# Altium project lab3_kulikov_heat_control.PrjPcb
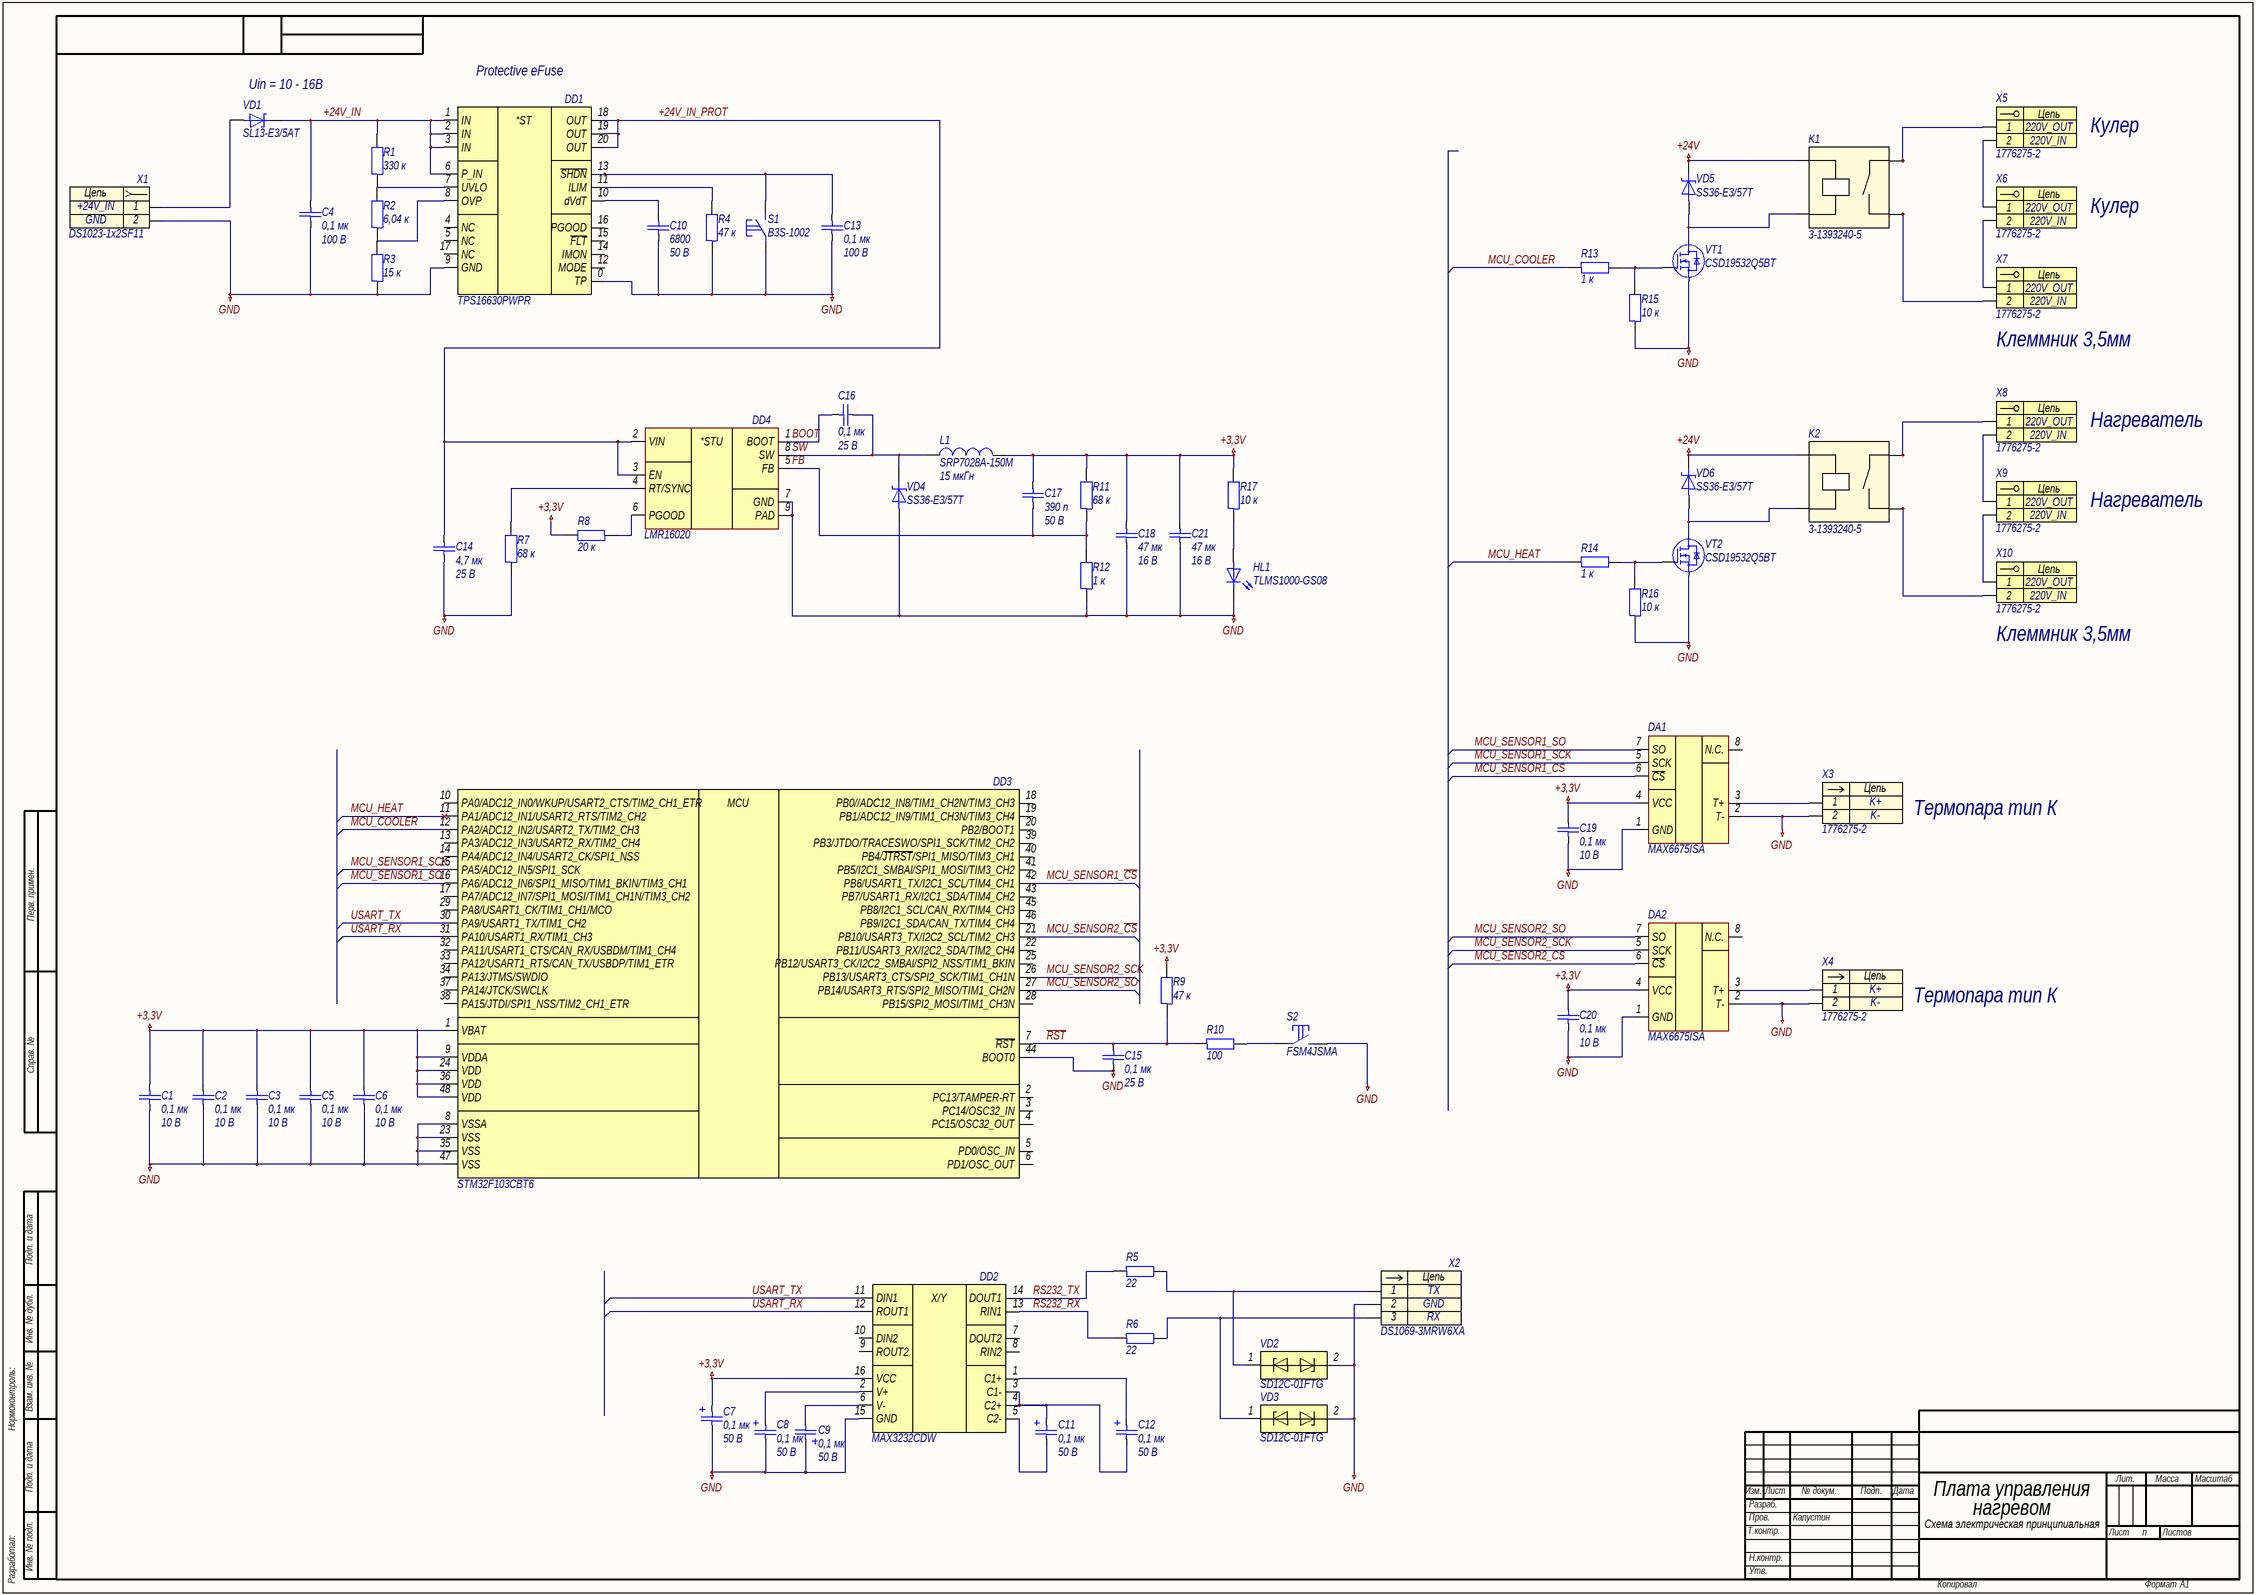
[diagram p0: lab3_kulikov_heat_control.SchDoc]
title_line_2: нагревом; title_line_1: Плата управления; title: Плата управления нагревом; sheets_total: 1; project: Плата управления нагревом; pcb_dec_number: СПБПУ.3331506.014; document_type: Схема электрическая принципиальная; document_code: Ý3; developer: Куликов; designation: СПБПУ.3331506.014; check: Капустин; approver: Капустин
1 sheet, 68 parts. Net scope: global (net labels, ports and power ports of the same name join across sheets).
Board file: lab3_kulikov_heat_control.PcbDoc

## Sheet lab3_kulikov_heat_control.SchDoc: Плата управления нагревом
size 840 x 594 mm; ApprovedBy: Капустин; CheckedBy: Капустин; DrawnBy: Куликов; DocumentNumber: СПБПУ.3331506.014Ý3; SheetNumber: n; SheetTotal: 1; DocumentCode: Ý3; ImagePath: СПБПУ.3331506.014

### Parts
C1  0,1 мк  Напряжение: 10 В  [C0402]
C2  0,1 мк  Напряжение: 10 В  [C0402]
C3  0,1 мк  Напряжение: 10 В  [C0402]
C4  0,1 мк  Напряжение: 100 В  [C0603]
C5  0,1 мк  Напряжение: 10 В  [C0402]
C6  0,1 мк  Напряжение: 10 В  [C0402]
C7  0,1 мк  Напряжение: 50 В  [C3216-18]
C8  0,1 мк  Напряжение: 50 В  [C3216-18]
C9  0,1 мк  Напряжение: 50 В  [C3216-18]
C10  6800  Напряжение: 50 В  [C0402]
C11  0,1 мк  Напряжение: 50 В  [C3216-18]
C12  0,1 мк  Напряжение: 50 В  [C3216-18]
C13  0,1 мк  Напряжение: 100 В  [C0603]
C14  4,7 мк  Напряжение: 25 В  [C1206]
C15  0,1 мк  Напряжение: 25 В  [C0603]
C16  0,1 мк  Напряжение: 25 В  [C0402]
C17  390 п  Напряжение: 50 В  [C0603]
C18  47 мк  Напряжение: 16 В  [C1210]
C19  0,1 мк  Напряжение: 10 В  [C0603]
C20  0,1 мк  Напряжение: 10 В  [C0603]
C21  47 мк  Напряжение: 16 В  [C1210]
DA1  MAX6675ISA  [SOIC127P600X175-8N]
DA2  MAX6675ISA  [SOIC127P600X175-8N]
DD1  TPS16630PWPR  [HTSSOP-20-P65-650X440X120-L63X25-T296X296]
DD2  MAX3232CDW  [SOIC-16-P127-1030X750X265-L84X41]
DD3  STM32F103CBT6  [LQFP-48-P50-700X700X160-L60X22]
DD4  LMR16020  [SOIC127P600X170_HS-9N]
HL1  TLMS1000-GS08  [HL0603]
K1  3-1393240-5  [TE_3-1393240-5]
K2  3-1393240-5  [TE_3-1393240-5]
L1  SRP7028A-150M  Индуктивность: 15 мкГн  [SRP-2-730X660X280]
R1  330 к  [R0603]
R2  6,04 к  [R0603]
R3  15 к  [R0603]
R4  47 к  [R0603]
R5  22  [R0603]
R6  22  [R0603]
R7  68 к  [R0603]
R8  20 к  [R0603]
R9  47 к  [R0603]
R10  100  [R0603]
R11  68 к  [R0603]
R12  1 к  [R0603]
R13  1 к  [R0603]
R14  1 к  [R0603]
R15  10 к  [R0603]
R16  10 к  [R0603]
R17  10 к  [R0603]
S1  B3S-1002  [B3S-1002]
S2  FSM4JSMA  [FSM4JSMA]
VD1  SL13-E3/5AT  [DO-214AC-510X270X229]
VD2  SD12C-01FTG  [SOD-323-257X130X114]
VD3  SD12C-01FTG  [SOD-323-257X130X114]
VD4  SS36-E3/57T  [DO-214AB-790X590X262]
VD5  SS36-E3/57T  [DO-214AB-790X590X262]
VD6  SS36-E3/57T  [DO-214AB-790X590X262]
VT1  CSD19532Q5BT  [VSONP-8-P127-600X500X105]
VT2  CSD19532Q5BT  [VSONP-8-P127-600X500X105]
X1  DS1023-1x2SF11  [DS1023-1X2SF11]
X2  DS1069-3MRW6XA  [DS1069-3MRW6XA]
X3  1776275-2  [1776275-2]
X4  1776275-2  [1776275-2]
X5  1776275-2  [1776275-2]
X6  1776275-2  [1776275-2]
X7  1776275-2  [1776275-2]
X8  1776275-2  [1776275-2]
X9  1776275-2  [1776275-2]
X10  1776275-2  [1776275-2]

### Nets
+3,3V: C1.1 C2.1 C3.1 C5.1 C6.1 C7.1 C17.1 C18.1 C19.1 C20.1 C21.1 DA1.4(VCC) DA2.4(VCC) DD2.16(VCC) DD3.1(VBAT) DD3.9(VDDA) DD3.24(VDD) DD3.36(VDD) DD3.48(VDD) L1.2 R8.2 R9.2 R11.2 R17.2
+24V: K1.A1 K2.A1 VD5.1 VD6.1
GND: C1.2 C2.2 C3.2 C4.2 C5.2 C6.2 C7.2 C8.2 C9.1 C10.2 C13.2 C14.2 C15.2 C18.2 C19.2 C20.2 C21.2 DA1.1(GND) DA1.2(T-) DA2.1(GND) DA2.2(T-) DD1.0(TP) DD1.9(GND) DD2.15(GND) DD3.8(VSSA) DD3.23(VSS) DD3.35(VSS) DD3.44(BOOT0) DD3.47(VSS) DD4.7(GND) DD4.9(PAD) HL1.1 R3.1 R4.1 R7.1 R12.1 R15.1 R16.1 S1.1 S2.2 VD2.2 VD3.2 VD4.2 VT1.S VT2.S X1.2 X2.2 X3.2 X4.2
+24V_IN: C4.1 DD1.1(IN) DD1.2(IN) DD1.3(IN) DD1.6(P_IN) R1.2 VD1.1
+24V_IN_PROT: C14.1 DD1.18(OUT) DD1.19(OUT) DD1.20(OUT) DD4.2(VIN) DD4.3(EN)
BOOT: C16.2 DD4.1(BOOT)
FB: C17.2 DD4.5(FB) R11.1 R12.2
MCU_COOLER: DD3.12(PA2/ADC12_IN2/USART2_TX/TIM2_CH3) R13.1
MCU_HEAT: DD3.11(PA1/ADC12_IN1/USART2_RTS/TIM2_CH2) R14.1
MCU_SENSOR1_~{CS}: DA1.6(~{CS}) DD3.42(PB6/USART1_TX/I2C1_SCL/TIM4_CH1)
MCU_SENSOR1_SCK: DA1.5(SCK) DD3.15(PA5/ADC12_IN5/SPI1_SCK)
MCU_SENSOR1_SO: DA1.7(SO) DD3.16(PA6/ADC12_IN6/SPI1_MISO/TIM1_BKIN/TIM3_CH1)
MCU_SENSOR2_~{CS}: DA2.6(~{CS}) DD3.21(PB10/USART3_TX/I2C2_SCL/TIM2_CH3)
MCU_SENSOR2_SCK: DA2.5(SCK) DD3.26(PB13/USART3_CTS/SPI2_SCK/TIM1_CH1N)
MCU_SENSOR2_SO: DA2.7(SO) DD3.27(PB14/USART3_RTS/SPI2_MISO/TIM1_CH2N)
~{RST}: C15.1 DD3.7(~{RST}) R9.1 R10.1
RS232_RX: DD2.13(RIN1) R6.1
RS232_TX: DD2.14(DOUT1) R5.1
SW: C16.1 DD4.8(SW) L1.1 VD4.1
USART_RX: DD2.12(ROUT1) DD3.31(PA10/USART1_RX/TIM1_CH3)
USART_TX: DD2.11(DIN1) DD3.30(PA9/USART1_TX/TIM1_CH2)
NetC8_1: C8.1 DD2.2(V+)
NetC9_2: C9.2 DD2.6(V-)
NetC10_1: C10.1 DD1.10(dVdT)
NetC11_1: C11.1 C12.2 DD2.3(C1-) DD2.4(C2+)
NetC11_2: C11.2 DD2.5(C2-)
NetC12_1: C12.1 DD2.1(C1+)
NetC13_1: C13.1 DD1.13(~{SHDN}) S1.2
NetDA1_3: DA1.3(T+) X3.1
NetDA2_3: DA2.3(T+) X4.1
NetDD1_7: DD1.7(UVLO) R1.1 R2.2
NetDD1_8: DD1.8(OVP) R2.1 R3.2
NetDD1_11: DD1.11(ILIM) R4.2
NetDD4_4: DD4.4(RT/SYNC) R7.2
NetDD4_6: DD4.6(PGOOD) R8.1
NetHL1_2: HL1.2 R17.1
NetK1_11: K1.11 K1.11-1 X5.1
NetK1_14: K1.14 K1.14-1 X7.2
NetK1_A2: K1.A2 VD5.2 VT1.D
NetK2_11: K2.11 K2.11-1 X8.1
NetK2_14: K2.14 K2.14-1 X10.2
NetK2_A2: K2.A2 VD6.2 VT2.D
NetR5_2: R5.2 VD2.1 X2.1
NetR6_2: R6.2 VD3.1 X2.3
NetR10_2: R10.2 S2.1
NetR13_2: R13.2 R15.2 VT1.G
NetR14_2: R14.2 R16.2 VT2.G
NetVD1_2: VD1.2 X1.1
NetX5_2: X5.2 X6.1
NetX6_2: X6.2 X7.1
NetX8_2: X8.2 X9.1
NetX9_2: X9.2 X10.1

Not connected (* = marked no-connect by the designer): DA1 8(N.C.); DA2 8(N.C.); DD1 4(NC) 5(NC) 12(MODE) 14(IMON) 15(~{FLT}) 16(PGOOD) 17(NC); DD2 7(DOUT2) 8(RIN2) 9(ROUT2) 10(DIN2); DD3 2(PC13/TAMPER-RT) 3(PC14/OSC32_IN) 4(PC15/OSC32_OUT) 5(PD0/OSC_IN) 6(PD1/OSC_OUT) 10(PA0/ADC12_IN0/WKUP/USART2_CTS/TIM2_CH1_ETR) 13(PA3/ADC12_IN3/USART2_RX/TIM2_CH4) 14(PA4/ADC12_IN4/USART2_CK/SPI1_NSS) 17(PA7/ADC12_IN7/SPI1_MOSI/TIM1_CH1N/TIM3_CH2) 18(PB0//ADC12_IN8/TIM1_CH2N/TIM3_CH3) 19(PB1/ADC12_IN9/TIM1_CH3N/TIM3_CH4) 20(PB2/BOOT1) 22(PB11/USART3_RX/I2C2_SDA/TIM2_CH4) 25(PB12/USART3_CK/I2C2_SMBAl/SPI2_NSS/TIM1_BKIN) 28(PB15/SPI2_MOSI/TIM1_CH3N) 29(PA8/USART1_CK/TIM1_CH1/MCO) 32(PA11/USART1_CTS/CAN_RX/USBDM/TIM1_CH4) 33(PA12/USART1_RTS/CAN_TX/USBDP/TIM1_ETR) 34(PA13/JTMS/SWDIO) 37(PA14/JTCK/SWCLK) 38(PA15/JTDI/SPI1_NSS/TIM2_CH1_ETR) 39(PB3/JTDO/TRACESWO/SPI1_SCK/TIM2_CH2) 40(PB4/~{JTRST}/SPI1_MISO/TIM3_CH1) 41(PB5/I2C1_SMBAl/SPI1_MOSI/TIM3_CH2) 43(PB7/USART1_RX/I2C1_SDA/TIM4_CH2) 45(PB8/I2C1_SCL/CAN_RX/TIM4_CH3) 46(PB9/I2C1_SDA/CAN_TX/TIM4_CH4)

### Notes on the sheet
- (near VD1) Uin = 10 - 16В
- Protective eFuse
- Кулер
- Клеммник 3,5мм
- Нагреватель
- Термопара тип К
- Перв. примен.
- Справ. №
- Подп. и дата
- Инв. № дубл.
- Нормоконтроль:
- Взам. инв. №
- Изм.
- Лист
- № докум.
- Подп.
- Дата
- Лит.
- Масса
- Масштаб
- Т.контр.
- Пров.
- Разраб.
- Листов
- Разработал:
- Инв. № подл.
- Н.контр.
- Утв.
- Копировал
- Формат
- А1
- (in symbol Component_1) *STU
- (in symbol dd0001) MCU
- (in symbol dd0007) *ST
- (in symbol dd0016) X/Y
- (in symbol x0005) Цепь
- (in symbol x0008) Цепь
- (in symbol x0023) Цепь
- (in symbol x0032) Цепь

### Library data of the parts
C1-C3 C5 C6 = c0080: =Описание; ID: c0080; Фамилия: Паньков; Описание: Конденсатор керамический чип 0402 100 нФ 10 В ±10 %; Наименование: CC0402KRX5R6BB104; Производитель: YAGEO Corp.; Отклонение: ±10 %; Рабочие температуры: от –55 °С до +85 °С; Температурный коэффициент емкости: X5R; Корпус: 0402; Номинал: 0,1 мк; Номинальное напряжение: 10 В; HelpURL: https://www.yageo.com/upload/media/product/productsearch/datasheet/mlcc/UPY-GPHC_X5R_4V-to-50V_26.pdf
C4 = c0098: =Описание; ID: c0098; Фамилия: Ларионов; Описание: Конденсатор керамический чип 1206 1 мкФ 100 В ±10 %; Наименование: CC1206KKX7R0BB105; Производитель: YAGEO Corp.; Номинал: 1 мк; Отклонение: ±10 %; Рабочие температуры: от –55 °С до +125 °С; Температурный коэффициент емкости: X7R; Корпус: 1206; Номинальное напряжение: 100 В; HelpURL: https://www.yageo.com/upload/media/product/productsearch/datasheet/mlcc/UPY-NP0X7R_MV_100-to-630V_22.pdf
C7-C9 C11 C12 = c0001: =Описание; ID: c0001; Фамилия: Ларионов; Описание: Конденсатор танталовый чип 3216-18 100 нФ 50 В ±10 %; Наименование: 293D104X9050A2TE3; Производитель: Vishay Intertechnology, Inc.; Отклонение: ±10 %; Эквивалентное последовательное сопротивление: 19,0 Ом; Среднеквадратичный размах пульсации тока: 0,06 А; Рабочие температуры: от –55 °С до +125 °С; Корпус: 3216-18; Номинал: 0,1 мк; Номинальное напряжение: 50 В; HelpURL: https://www.vishay.com/capacitors/list/product-40002/
C10 = c0008: =Описание; ID: c0008; Фамилия: Жернаков; Описание: Конденсатор керамический чип 0402 6,8 нФ 50 В ±5 %; Наименование: CL05B682JB5NNNC; Производитель: Samsung Electro-Mechanics; Отклонение: ±5 %; Рабочие температуры: от –55 °С до +125 °С; Температурный коэффициент емкости: X7R; Корпус: 0402; Номинал: 6800; Номинальное напряжение: 50 В; HelpURL: http://product.samsungsem.com/mlcc/CL05B682JB5NNN.do
C13 = c0018: =Описание; ID: c0018; Фамилия: Ларионов; Описание: Конденсатор чип 0603 0,1 мкФ 100 В ±10 %; Наименование: CC0603KRX7R0BB104; Производитель: YAGEO Corp.; Отклонение: ±10 %; Рабочие температуры: от -55 °С до +125 °С; Корпус: 0603; Номинал: 0,1 мк; Номинальное напряжение: 100 В; HelpURL: https://www.yageo.com/upload/media/product/productsearch/datasheet/mlcc/UPY-NP0X7R_MV_100-to-630V_22.pdf
C14 = c0105: =Описание; ID: c0122; Фамилия: Куликов; Описание: Конденсатор чип 1206 4,7 мкФ 25 В ±10 %; Наименование: GRM31CR71E475KA88L; Производитель: MuRata; Отклонение: ±10 %; Рабочие температуры: от –55 °С до +125 °С; Температурный коэффициент емкости: X7R; Корпус: 1206; Номинал: 4,7 мк; Номинальное напряжение: 25 В; HelpURL: https://www.murata.com/en-global/search/productsearch?cate=cgCapacitors&partno=GRM31CR71E475KA88L
C15 = c0058: =Описание; ID: c0058; Фамилия: Паньков; Описание: Конденсатор керамический чип 0603 100 нФ 25 В ±10 %; Наименование: CC0603KRX7R8BB104; Производитель: YAGEO Corp.; Отклонение: ±10 %; Рабочие температуры: от –55 °С до +125 °С; Температурный коэффициент емкости: X7R; Корпус: 0603; Номинал: 0,1 мк; Номинальное напряжение: 25 В; HelpURL: https://www.yageo.com/upload/media/product/productsearch/datasheet/mlcc/UPY-GPHC_X7R_6.3V-to-50V_20.pdf
C16 = c0084: =Описание; ID: c0084; Фамилия: Паньков; Описание: Конденсатор керамический чип 0402 100 нФ 25 В ±10 %; Наименование: CC0402KRX5R8BB104; Производитель: YAGEO Corp.; Отклонение: ±10 %; Рабочие температуры: от –55 °С до +85 °С; Температурный коэффициент емкости: X5R; Корпус: 0402; Номинал: 0,1 мк; Номинальное напряжение: 25 В; HelpURL: https://www.yageo.com/upload/media/product/productsearch/datasheet/mlcc/UPY-GPHC_X5R_4V-to-50V_26.pdf
C17 = c0019: =Описание; ID: c0120; Фамилия: Куликов; Описание: Конденсатор чип 0603 390 пФ 50 В ±10 %; Наименование: GRM1885C1H391JA01D; Производитель: MuRata; Отклонение: ±10 %; Рабочие температуры: от –55 °С до +125 °С; Температурный коэффициент емкости: X7R; Корпус: 0603; Номинал: 390 п; Номинальное напряжение: 50 В; HelpURL: https://www.yageo.com/upload/media/product/products/datasheet/mlcc/UPY-GPHC_X7R_6.3V-to-50V_20.pdf
C18 C21 = c0171: =Описание; ID: c0171; Фамилия: Паньков; Описание: Конденсатор керамический чип 1210 47 мкФ 16 В ±10 %; Наименование: CC1210KKX5R7BB476; Производитель: YAGEO Corp.; Отклонение: ±10 %; Рабочие температуры: от –55 °С до +85 °С; Температурный коэффициент емкости: X5R; Корпус: 1210; Номинал: 47 мк; Номинальное напряжение: 16 В; HelpURL: https://www.yageo.com/upload/media/product/productsearch/datasheet/mlcc/UPY-GPHC_X5R_4V-to-50V_26.pdf
C19 C20 = c0081: =Описание; ID: c0081; Фамилия: Паньков; Описание: Конденсатор керамический чип 0603 100 нФ 10 В ±10 %; Наименование: CC0603KRX7R6BB104; Производитель: YAGEO Corp.; Отклонение: ±10 %; Рабочие температуры: от –55 °С до +125 °С; Температурный коэффициент емкости: X7R; Корпус: 0603; Номинал: 0,1 мк; Номинальное напряжение: 10 В; HelpURL: https://www.yageo.com/upload/media/product/productsearch/datasheet/mlcc/UPY-GPHC_X7R_6.3V-to-50V_20.pdf
DA1 DA2 DD4 = Component_1
DD1 = dd0007: =Описание; ID: dd0007; Фамилия: Жернаков; Описание: Защитная микросхема eFuse 60 В и 6 А; Производитель: Texas Instruments Inc.; Напряжение: от 4,5 В до 60 В; Максимальное напряжение: 67 В; Ток: от 0,6 А до 6 А; Рабочие температуры: от –40 °С до +125 °С; Корпус: HTSSOP-20; Наименование: TPS16630PWPR; HelpURL: https://www.ti.com/product/TPS1663
DD2 = dd0016: =Описание; ID: dd0016; Фамилия: Паньков; Описание: Приемопередатчик RS-232; Производитель: Texas Instruments Inc.; Рабочие температуры: от 0 до +70 °C; Корпус: SOIC-16; Наименование: MAX3232CDW; HelpURL: https://www.ti.com/product/MAX3232
DD3 = dd0001: =Описание; ID: dd0001; Фамилия: Паньков; Описание: ARM Cortex-M3 32-разрядный микроконтроллер 72 МГц 128 Кбайт FLASH-памяти; Производитель: STMicroelectronics; Рабочее напряжение: от 2,0 В до 3,6 В; Максимальная тактовая частота: 72 МГц; Поддерживаемые интерфейсы: CAN, I2C, SPI, USART, USB; Рабочие температуры: от –40 °С до +85 °С; Корпус: LQFP-48; Наименование: STM32F103CBT6; HelpURL: https://www.st.com/en/microcontrollers-microprocessors/stm32f103cb.html
HL1 = hl0001: =Описание; ID: hl0001; Фамилия: Ларионов; Описание: Светодиод чип 0603 красный; Производитель: Vishay Intertechnology, Inc.; Цвет: Red; Номинальная сила света: 4 мкд; Номинальная длина волны: 628 нм; Номинальный прямой ток: 15 мА; Номинальное падение напряжения: 1,8 В; Рассеиваемая мощность: 40 мВт; Рабочие температуры: от –40 °С до +100 °С; Корпус: 0603; Наименование: TLMS1000-GS08; HelpURL: https://www.vishay.com/leds/list/product-83172/
K1 K2 = 3-1393240-5: General Purpose Relay, Power Pcb Relay Rt1 Series, Power, Non Latching, Spst, 24 Vdc, 16 A; MF: TE Connectivity; Availability: Warning; Package: None; MP: 3-1393240-5; Value: *; Purchase-URL: https://pricing.snapeda.com/search/part/3-1393240-5/?ref=eda; SnapEDA_Link: https://www.snapeda.com/parts/3-1393240-5/TE%20Connectivity%20Potter%20&%20Brumfield%20Relays/view-part/309548/?ref=snap; Price: None
L1 = l0012: =Описание; ID: l0012; Фамилия: Ляховский; Описание: Катушка индуктивности 15 мкГн ±20 %; Производитель: Bourns, Inc.; Отклонение: ±20 %; Номинальное активное сопротивление: 107 мОм; Максимальное активное сопротивление: 123 мОм; Резонансная частота: 12 МГц; Номинальный ток (при нагреве на 20 °С/40 °С): 3 А; Ток насыщения: 4 А; Рабочее напряжение: не указано; Рабочие температуры: от –55 °С до +150 °С; Корпус: 7,3 x 6,6 x 2,8; Наименование: SRP7028A-150M; Номинал: 15 мкГн; HelpURL: https://www.bourns.com/products/magnetic-products/power-inductors-aec-q200-compliant/product/SRP7028A
R1 = r0160: =Описание; ID: r0160; Фамилия: Паньков; Описание: Резистор чип 0603 330 кОм ±1 % 0,1 Вт; Наименование: RC0603FR-07330KL; Производитель: YAGEO Corp.; Отклонение: ±1 %; Номинальное напряжение: 75 В; Номинальный ток: 1 А; Рабочие температуры: от –55 °С до +155 °С; Корпус: 0603; Примечание: Ряд E24; Номинал: 330 к; HelpURL: https://www.yageo.com/upload/media/product/productsearch/datasheet/rchip/PYu-RC_Group_51_RoHS_L_11.pdf
R2 = r0098: =Описание; ID: r0098; Фамилия: Ларионов; Описание: Резистор чип 0603 6,04 кОм ±1 % 0,1 Вт; Наименование: RC0603FR-076K04L; Производитель: YAGEO Corp.; Отклонение: ±1 %; Номинальное напряжение: 75 В; Номинальный ток: 1 А; Рабочие температуры: от –55 °С до +155 °С; Корпус: 0603; Номинал: 6,04 к; HelpURL: https://www.yageo.com/upload/media/product/productsearch/datasheet/rchip/PYu-RC_Group_51_RoHS_L_11.pdf
R3 = r0111: =Описание; ID: r0111; Фамилия: Паньков; Описание: Резистор чип 0603 15 кОм ±1 % 0,1 Вт; Наименование: RC0603FR-0715KL; Производитель: YAGEO Corp.; Отклонение: ±1 %; Номинальное напряжение: 75 В; Номинальный ток: 1 А; Рабочие температуры: от –55 °С до +155 °С; Корпус: 0603; Примечание: Ряд E24; Номинал: 15 к; HelpURL: https://www.yageo.com/upload/media/product/productsearch/datasheet/rchip/PYu-RC_Group_51_RoHS_L_11.pdf
R4 = r0093: =Описание; ID: r0093; Фамилия: Жернаков; Описание: Резистор чип 0603 4,42 кОм ±1 % 0,1 Вт; Наименование: RC0603FR-074K42L; Производитель: YAGEO Corp.; Номинал: 4,42 к; Отклонение: ±1 %; Номинальное напряжение: 75 В; Номинальный ток: 1 А; Рабочие температуры: от –55 °С до +155 °С; Корпус: 0603; HelpURL: https://www.yageo.com/upload/media/product/productsearch/datasheet/rchip/PYu-RC_Group_51_RoHS_L_11.pdf
R5 R6 = r0034: =Описание; ID: r0034; Фамилия: Ларионов; Описание: Резистор чип 0603 22 Ом ±1 % 0,1 Вт; Наименование: RC0603FR-0722RL; Производитель: YAGEO Corp.; Отклонение: ±1 %; Номинальное напряжение: 75 В; Номинальный ток: 1 А; Рабочие температуры: от –55 °С до +155 °С; Корпус: 0603; Примечание: Ряд E24; Номинал: 22; HelpURL: https://www.yageo.com/upload/media/product/productsearch/datasheet/rchip/PYu-RC_Group_51_RoHS_L_11.pdf
R7 = r0083: =Описание; ID: r0083; Фамилия: Паньков; Описание: Резистор чип 0603 47 кОм ±1 % 0,1 Вт; Наименование: RC0603FR-0747KL; Производитель: YAGEO Corp.; Номинал: 47 к; Отклонение: ±1 %; Номинальное напряжение: 75 В; Рабочие температуры: от –55 °С до +155 °С; Номинальный ток: 1 А; Корпус: 0603; HelpURL: https://www.yageo.com/upload/media/product/productsearch/datasheet/rchip/PYu-RC_Group_51_RoHS_L_11.pdf
R8 = r0023: =Описание; ID: r0023; Фамилия: Водорезов; Описание: Резистор чип 0603 100 кОм ±1 % 0,2 Вт; Наименование: RC0603FR-07100KL; Производитель: YAGEO Corp.; Номинал: 100 к; Отклонение: ±1 %; Номинальное напряжение: 75 В; Рабочие температуры: от -55 °С до +155 °С; Номинальный ток: 1 А; Корпус: 0603; HelpURL: https://www.yageo.com/upload/media/product/productsearch/datasheet/rchip/PYu-RC_Group_51_RoHS_L_11.pdf
R9 = r0084: =Описание; ID: r0084; Фамилия: Паньков; Описание: Резистор чип 0603 47 кОм ±1 % 0,1 Вт; Наименование: RC0603FR-0747KL; Производитель: YAGEO Corp.; Отклонение: ±1 %; Номинальное напряжение: 75 В; Номинальный ток: 1 А; Рабочие температуры: от –55 °С до +155 °С; Корпус: 0603; Примечание: Ряд E24; Номинал: 47 к; HelpURL: https://www.yageo.com/upload/media/product/productsearch/datasheet/rchip/PYu-RC_Group_51_RoHS_L_11.pdf
R10 = r0007: =Описание; ID: r0007; Фамилия: Самарин; Описание: Резистор чип 0603 100 Ом ±1 % 0,1 Вт; Наименование: RC0603FR‍‐07100RL; Производитель: YAGEO Corp.; Отклонение: ±1 %; Номинальное напряжение: 75 В; Номинальный ток: 1 А; Рабочие температуры: от –55 °С до +155 °С; Корпус: 0603; Примечание: Ряд E24; Номинал: 100; HelpURL: https://www.yageo.com/upload/media/product/productsearch/datasheet/rchip/PYu-RC_Group_51_RoHS_L_11.pdf
R11 = r0089: =Описание; ID: r0089; Фамилия: Паньков; Описание: Резистор чип 0603 68 кОм ±1 % 0,1 Вт; Наименование: RC0603FR-0768KL; Производитель: YAGEO Corp.; Отклонение: ±1 %; Номинальное напряжение: 75 В; Рабочие температуры: от –55 °С до +155 °С; Номинальный ток: 1 А; Корпус: 0603; Номинал: 68 к; HelpURL: https://www.yageo.com/upload/media/product/productsearch/datasheet/rchip/PYu-RC_Group_51_RoHS_L_11.pdf
R12 = r0115: =Описание; ID: r0115; Фамилия: Паньков; Описание: Резистор чип 0603 20 кОм ±1 % 0,1 Вт; Наименование: RC0603FR-0720KL; Производитель: YAGEO Corp.; Номинал: 20 к; Отклонение: ±1 %; Номинальное напряжение: 75 В; Номинальный ток: 1 А; Рабочие температуры: от –55 °С до +155 °С; Корпус: 0603; Примечание: Ряд E24; HelpURL: https://www.yageo.com/upload/media/product/productsearch/datasheet/rchip/PYu-RC_Group_51_RoHS_L_11.pdf
R13 R14 = r0076: =Описание; ID: r0076; Фамилия: Ларионов; Описание: Резистор чип 0603 1 кОм ±1 % 0,1 Вт; Наименование: RC0603FR-071KL; Производитель: YAGEO Corp.; Отклонение: ±1 %; Номинальное напряжение: 75 В; Номинальный ток: 1 А; Рабочие температуры: от –55 °С до +155 °С; Корпус: 0603; Примечание: Ряд E24; Номинал: 1 к; HelpURL: https://www.yageo.com/upload/media/product/productsearch/datasheet/rchip/PYu-RC_Group_51_RoHS_L_11.pdf
R15 R16 = r0105: =Описание; ID: r0105; Фамилия: Самарин; Описание: Резистор чип 0603 10 кОм ±1 % 0,1 Вт; Наименование: RC0603FR-0710KL; Производитель: YAGEO Corp.; Отклонение: ±1 %; Номинальное напряжение: 75 В; Номинальный ток: 1 А; Рабочие температуры: от –55 °С до +155 °С; Корпус: 0603; Примечание: Ряд E24; Номинал: 10 к; HelpURL: https://www.yageo.com/upload/media/product/productsearch/datasheet/rchip/PYu-RC_Group_51_RoHS_L_11.pdf
R17 = r0052: =Описание; ID: r0052; Фамилия: Самарин; Описание: Резистор чип 0603 100 Ом ±1 % 0,1 Вт; Наименование: RC0603FR‍‐07100RL; Производитель: YAGEO Corp.; Номинал: 100; Отклонение: ±1 %; Номинальное напряжение: 75 В; Номинальный ток: 1 А; Рабочие температуры: от –55 °С до +155 °С; Корпус: 0603; Примечание: Ряд E24; HelpURL: https://www.yageo.com/upload/media/product/productsearch/datasheet/rchip/PYu-RC_Group_51_RoHS_L_11.pdf
S1 = s0003: =Описание; ID: s0003; Фамилия: Засецкий; Описание: Тактовая кнопка поверхностного монтажа; Производитель: OMRON Corporation; Ток нагрузки: 50 мА @ 24 В; Сопротивление контакта: 100 мОм; Количество контактов: 4; Рабочие температуры: от –25 °С до +70 °С; Промывка: Разрешена; Корпус: 6,00 x 6,60 x 4,30; Наименование: B3S-1002; HelpURL: https://components.omron.com/product-detail?partId=468
S2 = s0001: =Описание; ID: s0001; Фамилия: Паньков; Описание: Тактовая кнопка поверхностного монтажа; Производитель: TE Connectivity; Ток нагрузки: 50 мА @ 24 В; Сопротивление контакта: 100 мОм; Количество контактов: 4; Рабочие температуры: от –35 °С до +85 °С; Промывка: Запрещена; Корпус: 6,00 x 6,00 x 4,98; Наименование: FSM4JSMA; HelpURL: https://www.te.com/usa-en/product-4-1437565-1.html
VD1 = vd0003: =Описание; ID: vd0003; Фамилия: Ларионов; Описание: Диод Шоттки 30 В 1,5 А; Производитель: Vishay Intertechnology, Inc.; Максимальное прямое напряжение: 0,445 В; Максимальное обратное напряжение: 30 В; Максимальный прямой ток: 1,5 А; Рабочие температуры: от –55 °С до +125 °С; Корпус: DO-214AC; Наименование: SL13-E3/5AT; HelpURL: https://www.vishay.com/product?docid=88740
VD2 VD3 = vd0004: =Описание; ID: vd0004; Фамилия: Ларионов; Описание: Двунаправленная диодная сборка для подавления помех 12 В; Производитель: Littelfuse, Inc.; Корпус: SOD-323; Наименование: SD12C-01FTG; HelpURL: https://www.littelfuse.com/products/tvs-diode-arrays/general-purpose-esd-protection/sdc/sd12c_01ftg.aspx
VD4-VD6 = vd0005: =Описание; ID: vd0005; Фамилия: Жернаков; Описание: Диод Шоттки 60 В 3 А; Производитель: Vishay Intertechnology, Inc.; Максимальное прямое напряжение: 0,75 В; Максимальное обратное напряжение: 60 В; Максимальный прямой ток: 3 А; Рабочие температуры: от –55 °С до +150 °С; Корпус: DO-214AB; Наименование: SS36-E3/57T; HelpURL: https://www.vishay.com/product?docid=88751
VT1 VT2 = vt0005: =Описание; ID: vt0005; Фамилия: Жернаков; Описание: Полевой N-канальный МДП-транзистор 100 В 17 А; Производитель: Texas Instruments Inc.; Напряжение затвор — исток: ±20 В; Напряжение сток — исток: 100 В; Ток стока: 17 А; Сопротивление сток — исток: 5,7 мОм; Рабочие температуры: от –55 °С до +150 °С; Корпус: SON-8; Наименование: CSD19532Q5BT; HelpURL: https://www.ti.com/product/CSD19532Q5B
X1 = x0032: =Описание; Contact_1: +24V_IN; Contact_2: GND; ID: x0032; Фамилия: Паньков; Описание: PBS 2 pin 2,54 мм гнездо прямой; Производитель: Connfly Electronic Co., Ltd.; Наименование: DS1023-1x2SF11; HelpURL: http://en.connfly.group/product/xVkr=EusQssAN0gN=Aos=mU+UrVkR9kqEAN0gN0AUCUNB+A
X2 = x0023: =Описание; Contact_1: TX; Contact_2: GND; Contact_3: RX; ID: x0023; Фамилия: Паньков; Описание: CWF 3 pin Type A 2,5 мм вилка угловой; Производитель: Connfly Electronic Co., Ltd.; Наименование: DS1069-3MRW6XA; HelpURL: http://en.connfly.group/product/xVkr=EusQssAN0gN=Aos=mU+UrVkR9kqEAN0gN0MUR+g+NB+A
X3 X4 = x0008: =Описание; Contact_1: K+; Contact_2: K-; ID: x0008; Фамилия: Архипов; Описание: PLS 2 pin 2,54 мм вилка прямой; Наименование: 826629-2; Производитель: TE Connectivity; HelpURL: https://www.te.com/usa-en/product-826629-2.html
X5-X10 = x0005: =Описание; Contact_1: 220V_OUT; Contact_2: 220V_IN; ID: x0005; Фамилия: Паньков; Описание: Terminal Block 2 pin 3,5 мм; Производитель: TE Connectivity; Наименование: 1776275-2; HelpURL: https://www.te.com/usa-en/product-1776275-2.html